# EAGLE schematic MSE Temp Controller (EAGLE 6.5.0)
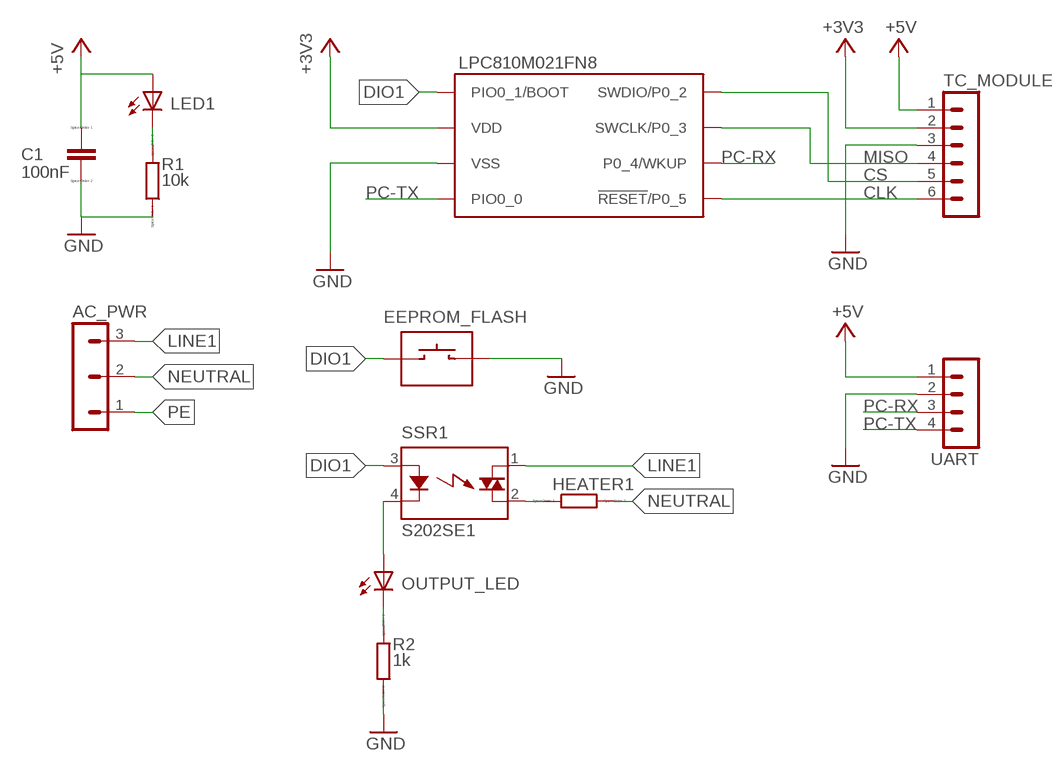
[diagram p0: schematic, sheet 1]

## Parts
AC_PWR  MA03-1  [MA03-1]
C1  100nF  CC0603  [C0603]
D1  CLM3C-WKW-CWBYA153  [PLCC2]
D2  CLM3C-WKW-CWBYA153  [PLCC2]
HEATER1  RR0402  [R0402]
R1  10k  RR0402  [R0402]
R2  1k  RR0402  [R0402]
S1  EVQ_Q2_Y01W  [EVQQ2]
SSR1  S202SE1  [S2XXEX]
TC_MODULE  MA06-1  [MA06-1]
U$1  LPC810M021FN8  [DIP8]
UART  MA04-1  [MA04-1]

## Nets
+3V3: TC_MODULE.2 U$1.P$6(VDD)
+5V: C1.1 D2.P$1(A) TC_MODULE.1 UART.1
CLK: TC_MODULE.6 U$1.P$1(!RESET!/P0_5)
CS: TC_MODULE.5 U$1.P$4(SWDIO/P0_2)
DIO1: S1.A1(A) S1.A2(A) SSR1.3(A) U$1.P$5(PIO0_1/BOOT)
GND: C1.2 R1.1 R2.2 S1.B1(B) S1.B2(B) TC_MODULE.3 U$1.P$7(VSS) UART.2
LINE1: AC_PWR.3 SSR1.1(DS1)
MISO: TC_MODULE.4 U$1.P$3(SWCLK/P0_3)
N$1: D2.P$2(C) R1.2
N$2: D1.P$1(A) SSR1.4(K)
N$3: HEATER1.1 SSR1.2(DS2)
N$4: D1.P$2(C) R2.1
NEUTRAL: AC_PWR.2 HEATER1.2
PC-RX: U$1.P$2(P0_4/WKUP) UART.3
PC-TX: U$1.P$8(PIO0_0) UART.4
PE: AC_PWR.1

## Library data of the parts
AC_PWR = con-lstb-test:MA03-1: PIN HEADER; OC_FARNELL: unknown; OC_NEWARK: unknown
C1 = eagle-ltspice:C: CAPACITOR, European symbol; SPICEMODEL: NONE; SPICEPREFIX: C
D1 D2 = carrilib:CLM3C-WKW-CWBYA153: PLCC2 LED, White Manufacturer: Cree Part Number: CLM3C-WKW-CWBYA153
HEATER1 R1 R2 = eagle-ltspice:R: RESISTOR, European symbol; SPICEMODEL: NONE; SPICEPREFIX: R
S1 = carrilib:EVQ_Q2_Y01W: Momentary Pushbutton, SMD Manufacturer: Panasonic Part Number: EVQ-Q2-Y01W (Or Other EVQ-Q2)
SSR1 = relay:S2*: SIP Type SSR for Medium Power Control SHARP Source: 168149-da-01-en-Solid_State_Relais_S_202_SE1_SE2.pdf; OC_FARNELL: unknown; OC_NEWARK: unknown
TC_MODULE = con-lstb:MA06-1: PIN HEADER; OC_FARNELL: unknown; OC_NEWARK: unknown
U$1 = carrilib:LPC810
UART = con-lstb:MA04-1: PIN HEADER; OC_FARNELL: unknown; OC_NEWARK: unknown